# EAGLE design PMTConn (EAGLE 9.6.2)
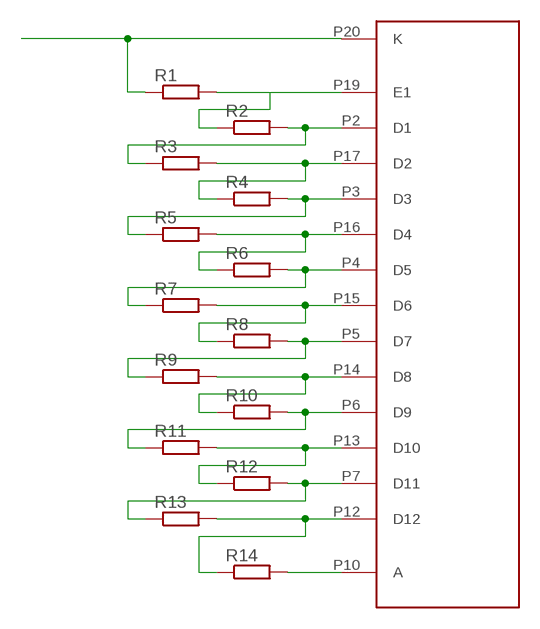
[diagram p0: schematic, sheet 1]

## Parts
R1  R-EU_0207/2V  [0207/2V]
R2  R-EU_0207/2V  [0207/2V]
R3  R-EU_0207/2V  [0207/2V]
R4  R-EU_0207/2V  [0207/2V]
R5  R-EU_0207/2V  [0207/2V]
R6  R-EU_0207/2V  [0207/2V]
R7  R-EU_0207/2V  [0207/2V]
R8  R-EU_0207/2V  [0207/2V]
R9  R-EU_0207/2V  [0207/2V]
R10  R-EU_0207/2V  [0207/2V]
R11  R-EU_0207/2V  [0207/2V]
R12  R-EU_0207/2V  [0207/2V]
R13  R-EU_0207/2V  [0207/2V]
R14  R-EU_0207/2V  [0207/2V]
U$1  M12FQC51  [PMT]

## Nets
N$1: R1.1 U$1.P20(K)
N$3: R1.2 R2.1 U$1.P19(E1)
N$4: R2.2 R3.1 U$1.P2(D1)
N$5: R3.2 R4.1 U$1.P17(D2)
N$6: R4.2 R5.1 U$1.P3(D3)
N$7: R5.2 R6.1 U$1.P16(D4)
N$8: R6.2 R7.1 U$1.P4(D5)
N$9: R7.2 R8.1 U$1.P15(D6)
N$10: R8.2 R9.1 U$1.P5(D7)
N$11: R9.2 R10.1 U$1.P14(D8)
N$12: R10.2 R11.1 U$1.P6(D9)
N$13: R11.2 R12.1 U$1.P13(D10)
N$14: R12.2 R13.1 U$1.P7(D11)
N$15: R13.2 R14.1 U$1.P12(D12)
N$16: R14.2 U$1.P10(A)

## Library data of the parts
R1-R14 = rcl:R-EU_: RESISTOR, European symbol; SPICEPREFIX: R
U$1 = PMT_Supply_LBR:M12FQC51

## Board
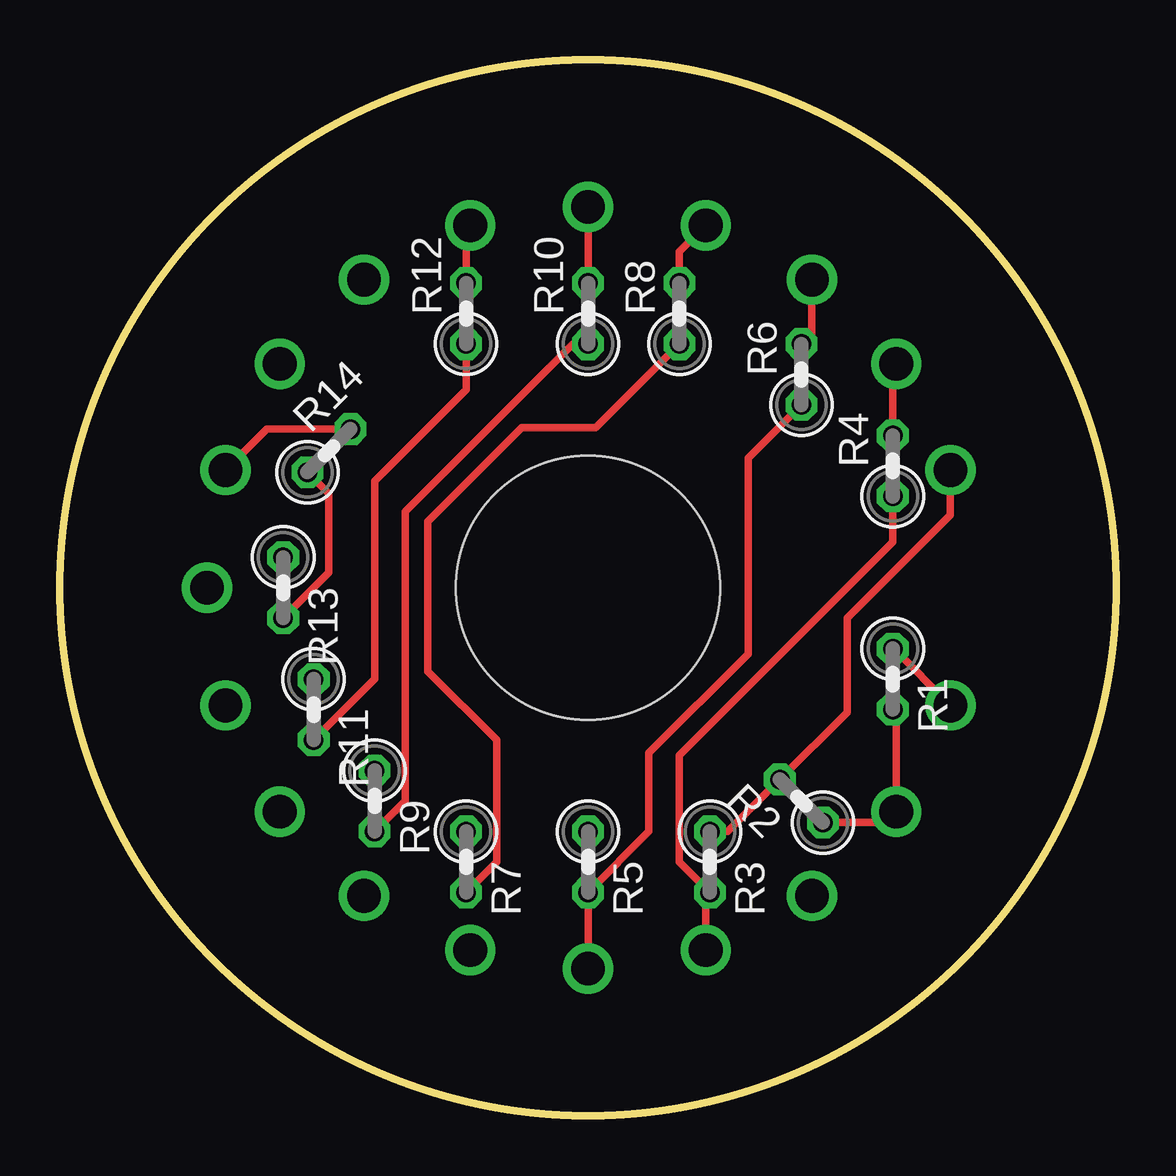
[diagram p1: board, top side]
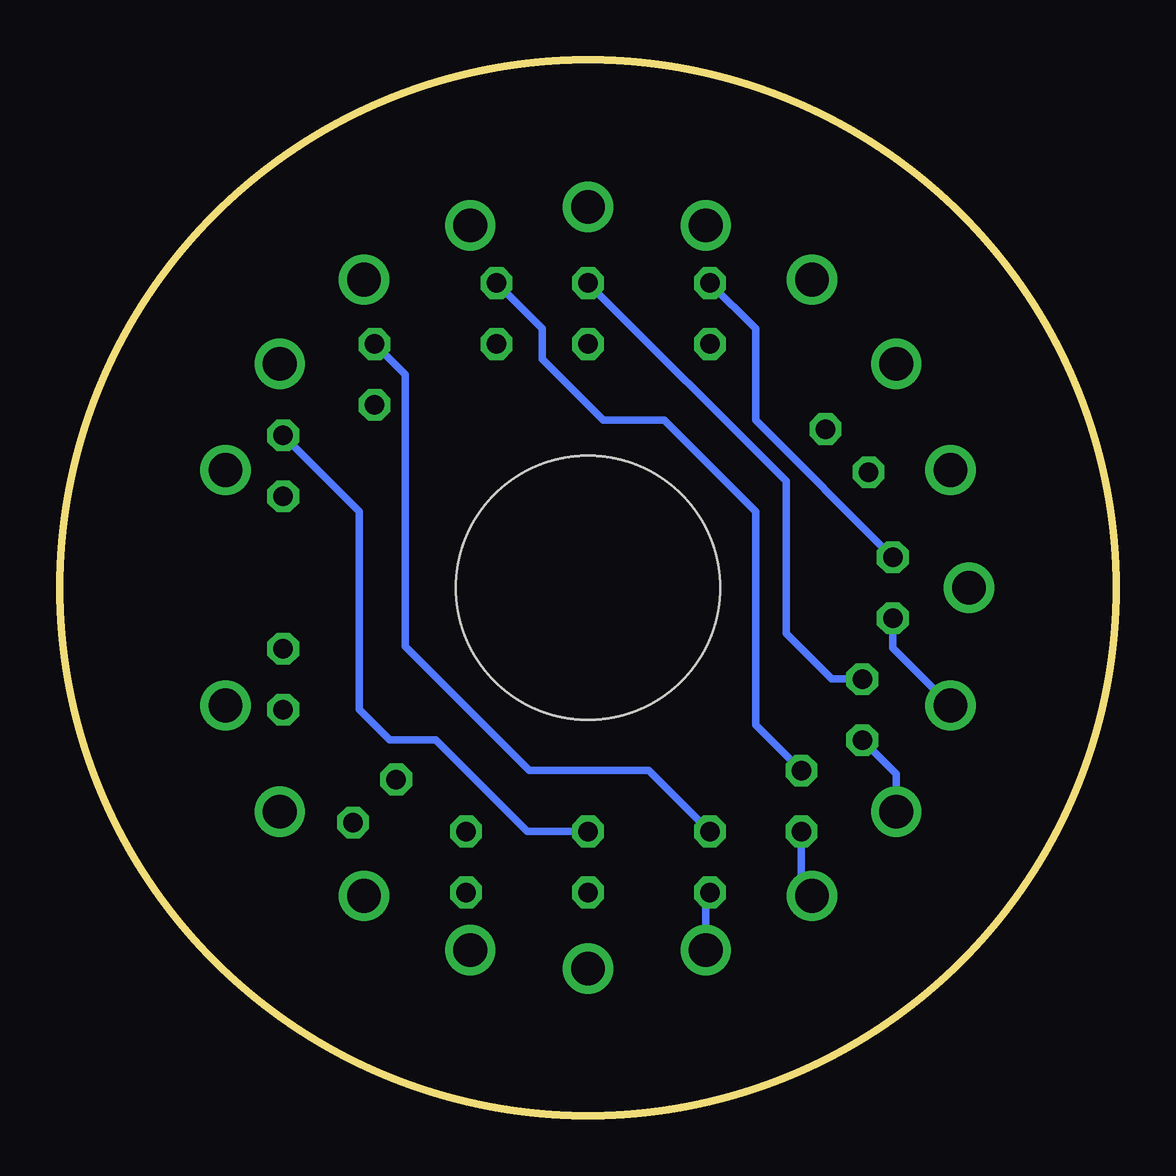
[diagram p2: board, bottom side, seen from below]

Size 44 x 44 mm. Coordinates in mm from the lower left corner, seen from the top.
Outline: circle at 22,22 radius 22
Copper layers (1*16): Top 0.035mm / dielectric 1.5mm / Bottom 0.035mm
Design rules "default": minimum track width 6mil, minimum drill 0.35mm, track to track 6mil, track to pad 6mil, pad to pad 6mil, via to via 6mil, smd to smd 6mil, copper to edge 40mil, drill to drill 6mil, minimum pad ring 10mil, minimum via ring 8mil, stop-mask expansion 4mil, vias tented up to drill 0mil, thermal gap 10mil

### Footprints (pad centres in the part's own frame; a part is rotated, then mirrored left to right if it is on the bottom)
0207/2V = drill 0.813 octagon: 1 -1.27,0; 2 1.27,0
PMT = drill 1.4: P2 15.098,4.906; P3 12.843,9.331; P4 9.331,12.843; P5 4.906,15.098; P6 0,15.875; P7 -4.906,15.098; P8 -9.331,12.843; P9 -12.843,9.331; P10 -15.098,4.906; P11 -15.875,0; P12 -15.098,-4.906; P13 -12.843,-9.331; P14 -9.331,-12.843; P15 -4.906,-15.098; P16 0,-15.875; P17 4.906,-15.098; P18 9.331,-12.843; P19 12.843,-9.331; P20 15.098,-4.906 | hole 11: 0,0

### Placement (x,y rotation side)
R1  34.7,18.19 270 top
R2  30.89,13.11 135 top
R3  27.08,10.57 270 top
R4  34.7,27.08 90 top
R5  22,10.57 270 top
R6  30.89,30.89 90 top
R7  16.92,10.57 270 top
R8  25.81,33.43 90 top
R9  13.11,13.11 270 top
R10  22,33.43 90 top
R11  10.57,16.92 270 top
R12  16.92,33.43 90 top
R13  9.3,22 270 top
R14  11.21,27.71 45 top
U$1  22,22 0 top

### Tracks (layer width: path | path; a pad name or v marks a point on that pad's centre or on a via)
N$1
  Top 0.305: U$1.P20 34.73,19.46 R1.1
N$3
  Top 0.305: R1.2 34.84,16.78 U$1.P19 34.39,12.21 R2.1
N$4
  Top 0.305: U$1.P2 37.1,25.03 32.8,20.73 32.8,16.81 R2.2 27.82,11.84 R3.1
N$5
  Top 0.305: U$1.P17 26.91,9.13 R3.2 25.81,10.57 25.81,15.02 34.7,23.91 R4.1
N$6
  Top 0.305: R4.2 34.7,31.19 U$1.P3
  Bottom 0.305: R4.2 31.52,25.17 31.52,16.92 30.26,15.65 28.35,15.65 24.54,11.84 R5.1
N$7
  Top 0.305: U$1.P16 R5.2 24.54,11.84 24.54,15.11 28.67,19.24 28.67,27.4 R6.1
N$8
  Top 0.305: R6.2 31.33,32.6 U$1.P4
  Bottom 0.305: R6.2 29.62,30.89 29.62,19.55 24.45,14.38 19.46,14.38 R7.1
N$9
  Top 0.305: R8.1 22.32,28.67 19.24,28.67 15.33,24.76 15.33,18.51 18.19,15.65 18.19,10.57 R7.2
  Bottom 0.305: R7.2 17.09,9.13 U$1.P15
N$10
  Top 0.305: R8.2 25.81,36 U$1.P5
  Bottom 0.305: R8.2 23.91,32.8 23.91,31.52 21.37,28.98 18.83,28.98 15.02,25.17 15.02,16.28 R9.1
N$11
  Top 0.305: R9.2 14.38,13.11 14.38,25.17 21.37,32.16 R10.1
  Bottom 0.305: R9.2 13.11,9.6 U$1.P14
N$12
  Top 0.305: R10.2 U$1.P6
  Bottom 0.305: R10.2 13.75,26.45 13.75,20.09 11.84,18.19 R11.1
N$13
  Top 0.305: R12.1 16.92,30.26 13.11,26.45 13.11,18.19 R11.2
  Bottom 0.305: R11.2 9.16,14.24 U$1.P13
N$14
  Top 0.305: R12.2 16.92,36.92 U$1.P7
  Bottom 0.305: R12.2 15.02,32.8 15.02,28.98 R13.1
N$15
  Top 0.305: R13.2 11.21,22.63 11.21,25.92 R14.1
  Bottom 0.305: R13.2 9.3,19.49 U$1.P12
N$16
  Top 0.305: U$1.P10 8.61,28.61 R14.2